# EAGLE design rocket-logger (EAGLE 6.2)
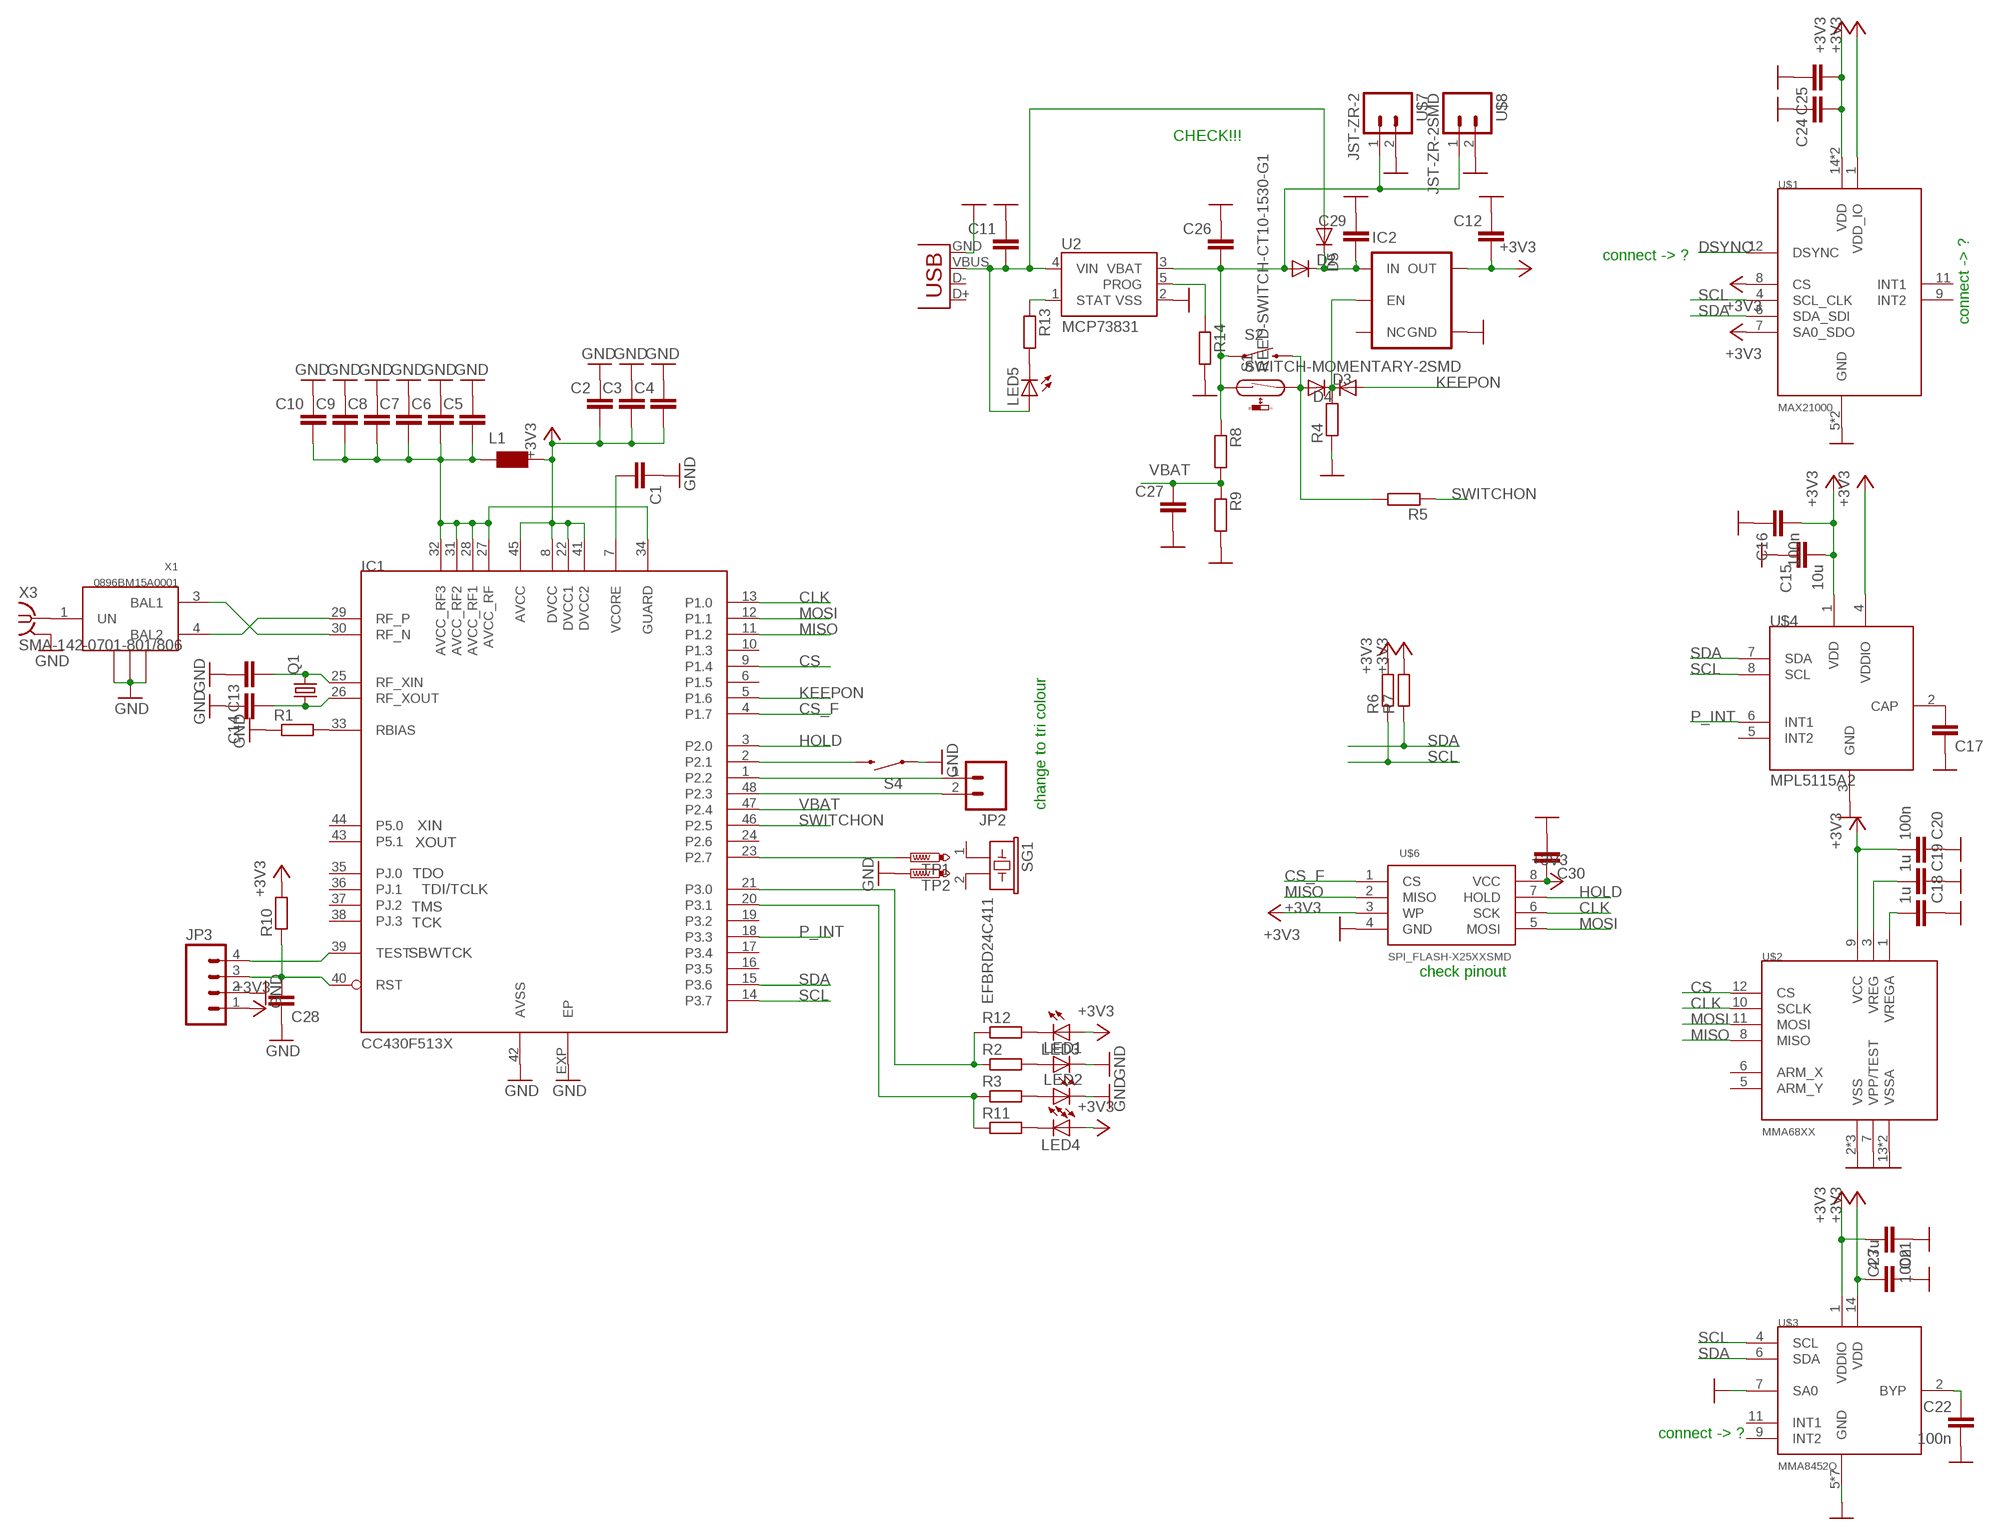
[diagram p0: schematic, sheet 1]

## Parts
C1  C-EUC0402  [C0402]
C2  C-EUC0402  [C0402]
C3  C-EUC0402  [C0402]
C4  C-EUC0402  [C0402]
C5  C-EUC0402  [C0402]
C6  C-EUC0402  [C0402]
C7  C-EUC0402  [C0402]
C8  C-EUC0402  [C0402]
C9  C-EUC0402  [C0402]
C10  C-EUC0402  [C0402]
C11  C-EUC0402  [C0402]
C12  C-EUC0402  [C0402]
C13  C-EUC0402  [C0402]
C14  C-EUC0402  [C0402]
C15  10u  C-EUC0402  [C0402]
C16  100n  C-EUC0402  [C0402]
C17  C-EUC0402  [C0402]
C18  1u  C-EUC0402  [C0402]
C19  1u  C-EUC0402  [C0402]
C20  100n  C-EUC0402  [C0402]
C21  4.7u  C-EUC0402  [C0402]
C22  100n  C-EUC0402  [C0402]
C23  100n  C-EUC0402  [C0402]
C24  C-EUC0402  [C0402]
C25  C-EUC0402  [C0402]
C26  C-EUC0402  [C0402]
C27  C-EUC0402  [C0402]
C28  C-EUC0402  [C0402]
C29  C-EUC0402  [C0402]
C30  C-EUC0402  [C0402]
D2  DIODE-SOD523  [SOD523]
D3  DIODE-SOD523  [SOD523]
D4  DIODE-SOD523  [SOD523]
D5  DIODE-SOD523  [SOD523]
IC1  CC430F513X  [QFN48]
IC2  V_REG_TPS76433SOT23-5  [SOT23-5]
JP2  M02PTH  [1X02]
JP3  M04PTH  [1X04]
L1  WE-MK_0603  [0603]
LED1  LED0603  [LED-0603]
LED2  LED0603  [LED-0603]
LED3  LED0603  [LED-0603]
LED4  LED0603  [LED-0603]
LED5  LED0603  [LED-0603]
Q1  CRYSTAL5X3  [CRYSTAL-SMD-5X3]
R1  R-EU_R0402  [R0402]
R2  R-EU_R0402  [R0402]
R3  R-EU_R0402  [R0402]
R4  R-EU_R0402  [R0402]
R5  R-EU_R0402  [R0402]
R6  R-EU_R0402  [R0402]
R7  R-EU_R0402  [R0402]
R8  R-EU_R0402  [R0402]
R9  R-EU_R0402  [R0402]
R10  R-EU_R0402  [R0402]
R11  R-EU_R0402  [R0402]
R12  R-EU_R0402  [R0402]
R13  R-EU_R0402  [R0402]
R14  R-EU_R0402  [R0402]
S1  REED-SWITCH-CT10-1530-G1  [CT10-G1]
S2  SWITCH-MOMENTARY-2SMD  [TACTILE_SWITCH_SMD]
S4  SWITCH-MOMENTARY-2SMD  [TACTILE_SWITCH_SMD]
SG1  EFBRD24C411  [EFBRD24C411]
TP1  PTR1B1,27  [B1,27]
TP2  PTR1B1,27  [B1,27]
U2  MCP73831  [SOT23-5]
U$1  MAX21000  [LGA16]
U$2  MMA68XX  [QFN16-6X6]
U$3  MMA8452Q  [QFN16-COL]
U$4  MPL5115A2  [LGA8]
U$6  SPI_FLASH-X25XXSMD  [SO08]
U$7  JST-ZR-2  [JST-ZR-2]
U$8  JST-ZR-2SMD  [JST-ZR-2-SMD]
X1  0896BM15A0001  [0896BM15A0001]
X2  USB-MICROB  [USB-MICROB]
X3  SMA-142-0701-801/806  [J502-ND-142-0701-801/806]

## Nets
+3V3: C2.2 C3.2 C4.2 C12.2 C15.2 C16.2 C20.2 C21.2 C23.1 C24.2 C25.2 C30.1 IC1.8(DVCC) IC1.22(DVCC1) IC1.41(DVCC2) IC1.45(AVCC) IC2.5(OUT) JP3.1 L1.2 LED3.A LED4.A R6.2 R7.2 R10.2 U$1.1(VDD_IO) U$1.7(SA0_SDO) U$1.8(CS) U$1.14(VDD) U$1.15(VDD) U$2.9(VCC) U$3.1(VDDIO) U$3.14(VDD) U$4.1(VDD) U$4.4(VDDIO) U$6.3(WP) U$6.8(VCC)
AVCC_RF2: C5.2 C6.2 C7.2 C8.2 C9.2 C10.2 IC1.27(AVCC_RF) IC1.28(AVCC_RF1) IC1.31(AVCC_RF2) IC1.32(AVCC_RF3) IC1.34(GUARD) L1.1
CLK: IC1.13(P1.0) U$2.10(SCLK) U$6.6(SCK)
CS: IC1.9(P1.4) U$2.12(CS)
CS_F: IC1.4(P1.7) U$6.1(CS)
DSYNC: U$1.12(DSYNC)
GND: C1.1 C2.1 C3.1 C4.1 C5.1 C6.1 C7.1 C8.1 C9.1 C10.1 C11.1 C12.1 C13.1 C14.1 C15.1 C16.1 C17.1 C18.1 C19.1 C20.1 C21.1 C22.2 C23.2 C24.1 C25.1 C26.1 C27.2 C28.1 C29.1 C30.2 IC1.42(AVSS) IC1.EXP(EP) IC2.2(GND) JP3.2 LED1.C LED2.C R1.1 R4.1 R9.2 R14.2 S4.1 TP2.TP U2.2(VSS) U$1.5(GND) U$1.10(GND) U$2.2(VSS) U$2.4(VSS) U$2.7(VPP/TEST) U$2.13(VSSA) U$2.16(VSSA) U$2.17(VSS) U$3.5(GND) U$3.7(SA0) U$3.8(GND) U$3.10(GND) U$3.12(GND) U$3.13(GND) U$3.15(GND) U$3.16(GND) U$4.3(GND) U$6.4(GND) U$7.2 U$8.2 X1.2(GND2) X1.5(GND) X1.6(GND1) X2.GND X3.G@1(GND)
HOLD: IC1.3(P2.0) U$6.7(HOLD)
KEEPON: D4.A IC1.5(P1.6)
MISO: IC1.11(P1.2) U$2.8(MISO) U$6.2(MISO)
MOSI: IC1.12(P1.1) U$2.11(MOSI) U$6.5(MOSI)
N$1: C11.2 D5.A LED5.A U2.4(VIN) X2.VBUS
N$2: C26.2 D2.A R8.1 S1.1 S2.1 U2.3(VBAT) U$7.1 U$8.1
N$3: IC1.30(RF_N) X1.3(BAL1)
N$4: IC1.29(RF_P) X1.4(BAL2)
N$5: IC1.33(RBIAS) R1.2
N$6: C13.2 IC1.25(RF_XIN) Q1.3
N$7: C14.2 IC1.26(RF_XOUT) Q1.1
N$8: X1.1(UN) X3.1
N$9: LED1.A R2.2
N$10: R13.1 U2.1(STAT)
N$11: IC1.1(P2.2) JP2.1
N$12: IC1.48(P2.3) JP2.2
N$13: C17.2 U$4.2(CAP)
N$14: C18.2 U$2.1(VREGA)
N$15: C19.2 U$2.3(VREG)
N$16: IC1.21(P3.0) R2.1 R12.1
N$17: IC1.20(P3.1) R3.1 R11.1
N$18: LED5.C R13.2
N$19: C22.1 U$3.2(BYP)
N$20: LED2.A R3.2
N$21: LED4.C R11.2
N$22: LED3.C R12.2
N$23: IC1.39(TEST) JP3.4
N$24: D3.A R5.2 S1.2 S2.3
N$25: D3.C D4.C IC2.3(EN) R4.2
N$26: C28.2 IC1.40(RST) JP3.3 R10.1
N$28: IC1.2(P2.1) S4.3
N$29: IC1.23(P2.7) TP1.TP
N$30: C29.2 D2.C D5.C IC2.1(IN)
N$33: R14.1 U2.5(PROG)
P_INT: IC1.18(P3.3) U$4.6(INT1)
SCL: IC1.14(P3.7) R6.1 U$1.4(SCL_CLK) U$3.4(SCL) U$4.8(SCL)
SDA: IC1.15(P3.6) R7.1 U$1.6(SDA_SDI) U$3.6(SDA) U$4.7(SDA)
SWITCHON: IC1.46(P2.5) R5.1
VBAT: C27.1 IC1.47(P2.4) R8.2 R9.1
VCORE: C1.2 IC1.7(VCORE)
Unconnected: IC1.6(P1.5) IC1.10(P1.3) IC1.16(P3.5) IC1.17(P3.4) IC1.19(P3.2) IC1.24(P2.6) IC1.35(PJ.0) IC1.36(PJ.1) IC1.37(PJ.2) IC1.38(PJ.3) IC1.43(P5.1) IC1.44(P5.0) IC2.4(NC) SG1.1 SG1.2 U$1.9(INT2) U$1.11(INT1) U$2.5(ARM_Y) U$2.6(ARM_X) U$3.9(INT2) U$3.11(INT1) U$4.5(INT2) X2.D+ X2.D-

## Notes on the sheet
- CHECK!!!
- connect -> ?
- connect -> ?
- change to tri colour
- check pinout
- connect -> ?

## Power pins joined to a net without a drawn wire
GND: X3.G@2(GND) X3.G@3(GND) X3.G@4(GND)

## Library data of the parts
C1-C30 = resistor:C-EU: CAPACITOR, European symbol
D2-D5 = diode:DIODE-: DIODE
IC1 = Mine:CC430F513X
IC2 = SparkFun:V_REG_TPS76433: Voltage Regulator Older TI part. LDO 150mA regulator. No output by-pass cap option. See V_REG_LDO for a better part.
JP2 = SparkFun:M02: Header 2 Standard 2-pin 0.1" header. Use with straight break away headers (SKU : PRT-00116), right angle break away headers (PRT-00553), swiss pins (PRT-00743), machine pins (PRT-00117), and female headers (PRT-00115). Molex polarized connector foot print use with SKU : PRT-08233 with associated crimp pins and housings.
JP3 = SparkFun:M04: Header 4 Standard 4-pin 0.1" header. Use with straight break away headers (SKU : PRT-00116), right angle break away headers (PRT-00553), swiss pins (PRT-00743), machine pins (PRT-00117), and female headers (PRT-00115). Molex polarized connector foot print use with SKU : PRT-08231 with associated crimp pins and housings.
L1 = wuerth-elektronik:WE-MK: SMD Multilayer Ceramic Inductors WE-MK - Windings printed on ceramic substrate - Extremely high SRF > 15 GHz - Inductance is stable over temperature -- High frequency circuits -- Bluetooth -- Wireless LAN -- Filter circuits
LED1-LED5 = SparkFun:LED: LEDs Standard schematic elements and footprints for 5mm, 3mm, 1206, and 0603 sized LEDs. 5mm - Spark Fun Electronics SKU : COM-00529 (and others)
Q1 = SparkFun:CRYSTAL: Crystals Various standard crystals. Proven footprints. Spark Fun Electronics SKU : COM-00534
R1-R14 = rcl:R-EU_: RESISTOR, European symbol
S1 = switch-reed:REED-SWITCH-: Reed Sensor; MF: COTO TECHNOLOGY; MPN: CT10-1530-G1; OC_FARNELL: 1081696
S2 S4 = SparkFun:SWITCH-MOMENTARY-2
SG1 = buzzer:EFB?: Piezoelectric Acoustic Transducer Source: Panbasonic .. 2SC1685.pdf; OC_FARNELL: unknown; OC_NEWARK: unknown
TP1 TP2 = testpad:PTR1: TEST PIN
U2 = SparkFun-PowerIC:MCP73831: Miniature single cell, fully integrated Li-Ion, Li-polymer charge management controller http://ww1.microchip.com/downloads/en/DeviceDoc/21984a.pdf IC-09995; PROD_ID: IC-09995
U$1 = Mine:MAX21000
U$2 = Mine:MMA68XX
U$3 = Mine:MMA8452Q
U$4 = Mine:MPL5115A2
U$6 = SparkFun:SPI_FLASH-X25XX: 8pin SPI Flash series x25xx. Works with devices like W25X32 and BR25L32
U$7 U$8 = Mine:JST-ZR-2
X1 = Mine:0896BM15A0001
X2 = SparkFun:USB: USB Connectors USB-B-PTH is fully proven SKU : PRT-00139 USB-miniB is fully proven SKU : PRT-00587 USB-A-PCB is untested. USB-A-H is throughly reviewed, but untested. Spark Fun Electronics SKU : PRT-00437 USB-B-SMT is throughly reviewed, but untested. Needs silkscreen touching up. USB-A-S has not been used/tested USB-MB-H has not been used/tested
X3 = con-coax:SMA-: SMA 50 Ohm End Launch Jack Receptacle - Round Contact Johnson Components Source: www.johnsoncomponents.com .. J502-ND.pdf; MF: JOHNSON COMPONENTS; MPN: 142-0701-801; OC_FARNELL: 1608592; OC_NEWARK: 90F2624

## Board
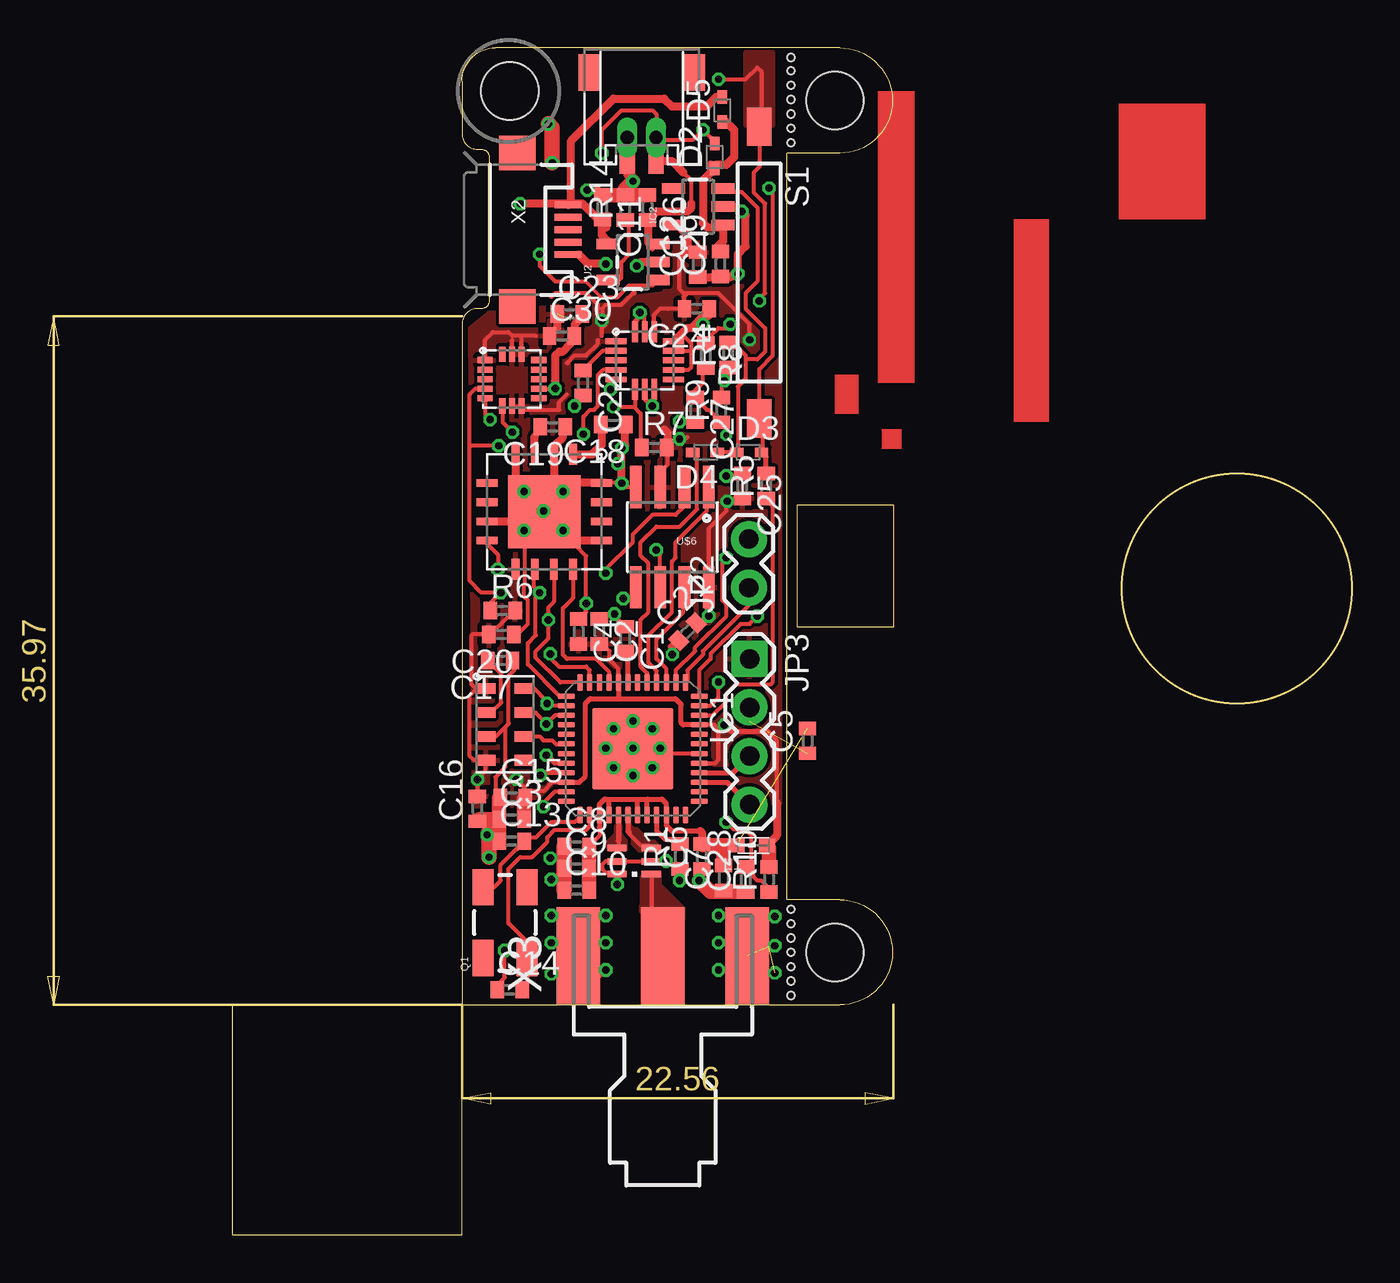
[diagram p1: board, top side]
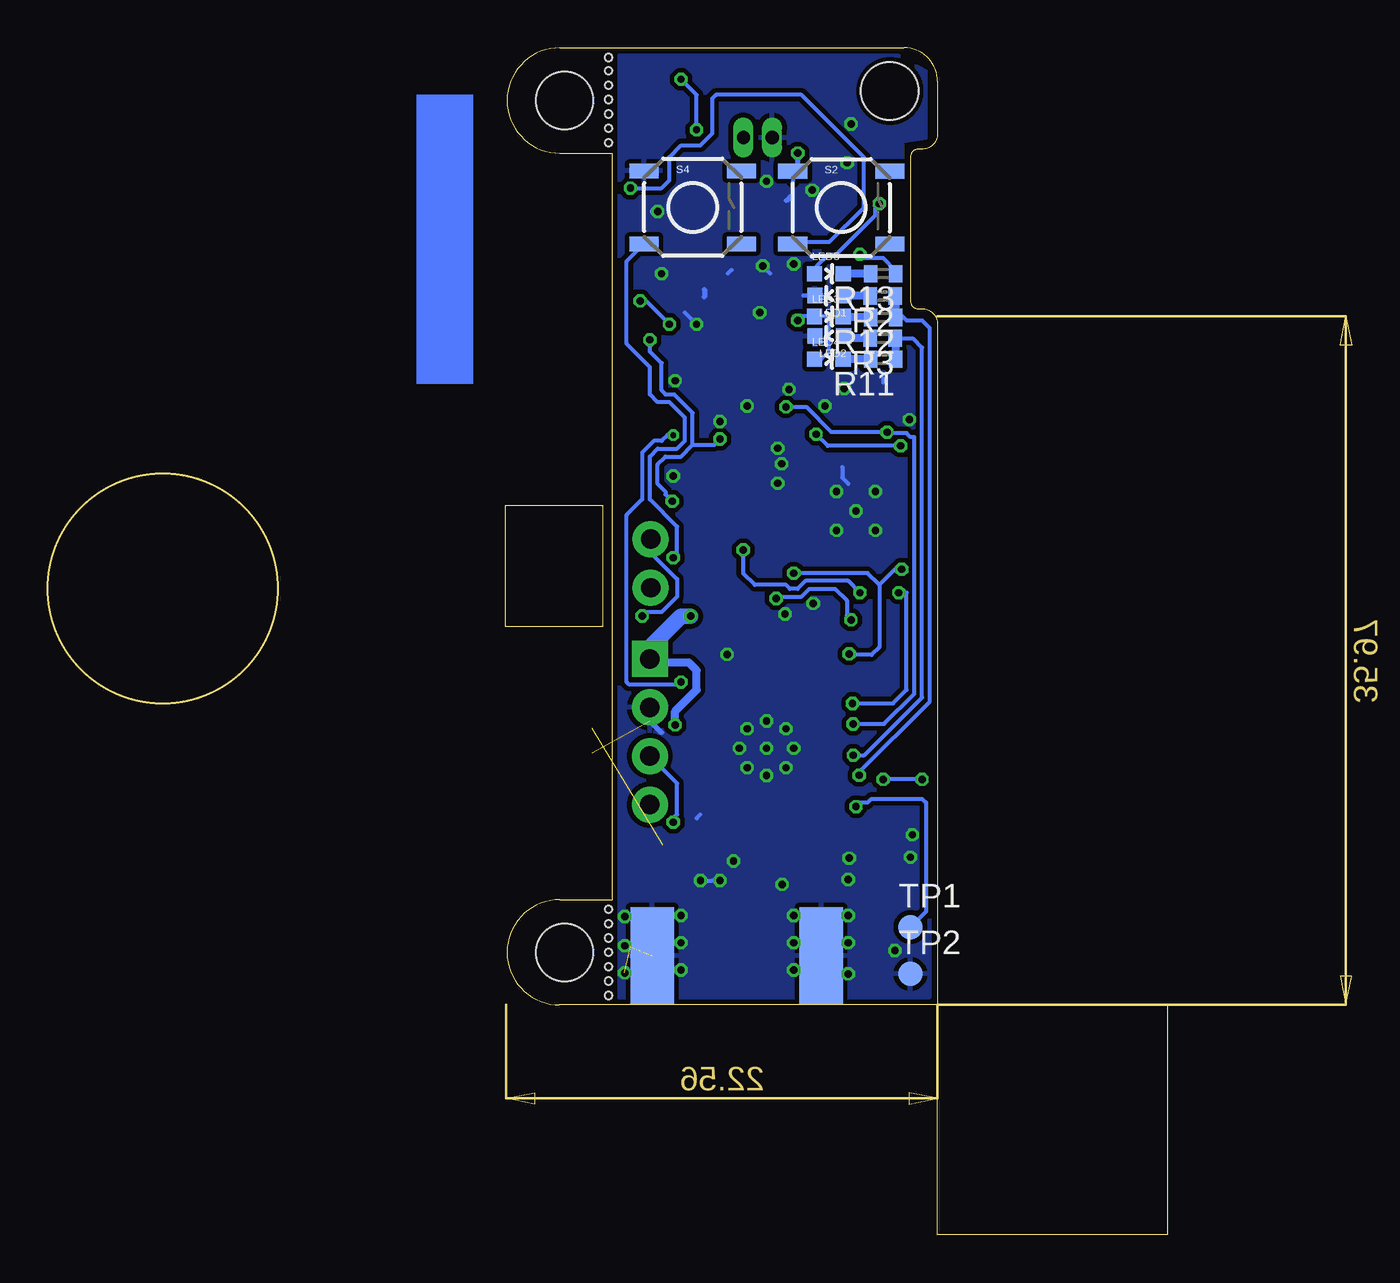
[diagram p2: board, bottom side, seen from below]

Size 58.5 x 62 mm. Coordinates in mm from the lower left corner, seen from the top.
Outline: 12,12 31.75,12 arc90 34.5,14.75 arc90 31.75,17.5 29,17.5 29,56.5 31.75,56.5 arc90 34.5,59.25 arc90 31.75,62 13.75,62 arc90 12,60.25 12,57.52 arc90 12.81,56.7 13.02,56.7 arc-90 13.42,56.3 13.42,48.78 arc-90 13.02,48.37 12.81,48.37 arc90 12,47.56 12,12
Outline: circle at 52.5,33.75 radius 6
Copper layers (1*16): Top 0.035mm / dielectric 0.2mm / Bottom 0.035mm
Design rules: minimum track width 6mil, minimum drill 12mil, track to track 7mil, track to pad 7mil, pad to pad 7mil, via to via 7mil, smd to smd 0mil, copper to edge 0mil, drill to drill 10mil, minimum pad ring 7mil, minimum via ring 6mil, stop-mask expansion 2mil, vias tented up to drill 25mil, thermal gap 10mil
Holes 3 mm at 14.5,59.75 31.5,14.75 31.5,59.25
Holes 0.38 mm at 29.2,57.05 29.2,57.8 29.2,58.55 29.2,59.3 29.2,60.05 29.2,60.8 29.2,61.5 29.2,17 29.2,16.25 29.2,15.5 29.2,14.75 29.2,14 29.2,13.25 29.2,12.5

### Footprints (pad centres in the part's own frame; a part is rotated, then mirrored left to right if it is on the bottom)
C0402 = smd 0.7 x 0.9: 1 -0.65,0; 2 0.65,0
SOD523 = smd 0.7 x 0.5: A 0.7,0; C -0.6,0
QFN48 = smd 0.9 x 0.3: 1 -3.462,2.75; 2 -3.462,2.25; 3 -3.462,1.75; 4 -3.462,1.25; 5 -3.462,0.75; 6 -3.462,0.25; 7 -3.462,-0.25; 8 -3.462,-0.75; 9 -3.462,-1.25; 10 -3.462,-1.75; 11 -3.462,-2.25; 12 -3.462,-2.75; 25 3.462,-2.75; 26 3.462,-2.25; 27 3.462,-1.75; 28 3.462,-1.25; 29 3.462,-0.75; 30 3.462,-0.25; 31 3.462,0.25; 32 3.462,0.75; 33 3.462,1.25; 34 3.462,1.75; 35 3.462,2.25; 36 3.462,2.75 | smd 0.3 x 0.9: 13 -2.75,-3.462; 14 -2.25,-3.462; 15 -1.75,-3.462; 16 -1.25,-3.462; 17 -0.75,-3.462; 18 -0.25,-3.462; 19 0.25,-3.462; 20 0.75,-3.462; 21 1.25,-3.462; 22 1.75,-3.462; 23 2.25,-3.462; 24 2.75,-3.462; 37 2.75,3.462; 38 2.25,3.462; 39 1.75,3.462; 40 1.25,3.462; 41 0.75,3.462; 42 0.25,3.462; 43 -0.25,3.462; 44 -0.75,3.462; 45 -1.25,3.462; 46 -1.75,3.462; 47 -2.25,3.462; 48 -2.75,3.462 | smd 4.25 x 4.25: EXP 0,0
SOT23-5 = smd 0.55 x 1.2: 1 -0.95,-1.3; 2 0,-1.3; 3 0.95,-1.3; 4 0.95,1.3; 5 -0.95,1.3
1X02 = drill 1.016 pad 1.88: 1 0,0; 2 2.54,0
1X04 = drill 1.016 pad 1.88 square: 1 0,0 | drill 1.016 pad 1.88: 2 2.54,0; 3 5.08,0; 4 7.62,0
0603 = smd 0.85 x 0.7: 1 -0.9,0; 2 0.7,0
LED-0603 = smd 0.8 x 0.8: A 0,-0.75; C 0,0.75
CRYSTAL-SMD-5X3 = smd 1.9 x 1.1: 1 -1.85,-1.15; 2 1.85,-1.15; 3 1.85,1.15; 4 -1.85,1.15
R0402 = smd 0.7 x 0.9: 1 -0.65,0; 2 0.65,0
CT10-G1 = smd 2 x 1.3: 1 -7.62,0; 2 7.62,0
TACTILE_SWITCH_SMD = smd 1.524 x 0.762: 1 -2.54,1.905; 2 2.54,1.905; 3 -2.54,-1.905; 4 2.54,-1.905
EFBRD24C411 = drill 1.1 pad 1.676: 1 -5,0; 2 5,0
B1,27 = smd 1.27 x 1.27: TP 0,0
LGA16 = smd 0.8 x 0.323: 1 -1.4,1; 2 -1.4,0.5; 3 -1.4,0; 4 -1.4,-0.5; 5 -1.4,-1; 9 1.4,-1; 10 1.4,-0.5; 11 1.4,0; 12 1.4,0.5; 13 1.4,1 | smd 0.323 x 0.8: 6 -0.5,-1.4; 7 0,-1.4; 8 0.5,-1.4; 14 0.5,1.3; 15 0,1.3; 16 -0.5,1.3
QFN16-6X6 = smd 1.1 x 0.4: 1 -3,1.5; 2 -3,0.5; 3 -3,-0.5; 4 -3,-1.5; 9 3,-1.5; 10 3,-0.5; 11 3,0.5; 12 3,1.5 | smd 0.4 x 1.1: 5 -1.5,-3; 6 -0.5,-3; 7 0.5,-3; 8 1.5,-3; 13 1.5,3; 14 0.5,3; 15 -0.5,3; 16 -1.5,3 | smd 3.8 x 3.8: 17 0,0
QFN16-COL = smd 1.1 x 0.3: 1 -1.5,1; 2 -1.5,0.5; 3 -1.5,0; 4 -1.5,-0.5; 5 -1.5,-1; 9 1.5,-1; 10 1.5,-0.5; 11 1.5,0; 12 1.5,0.5; 13 1.5,1 | smd 0.3 x 1.1: 6 -0.5,-1.5; 7 0,-1.5; 8 0.5,-1.5; 14 0.5,1.5; 15 0,1.5; 16 -0.5,1.5
LGA8 = smd 1 x 0.55: 1 -1,1.875; 2 -1,0.625; 3 -1,-0.625; 4 -1,-1.875; 5 1,-1.875; 6 1,-0.625; 7 1,0.625; 8 1,1.875
SO08 = smd 0.61 x 2.21: 1 -1.905,-2.616; 2 -0.635,-2.616; 3 0.635,-2.616; 4 1.905,-2.616; 5 1.905,2.616; 6 0.635,2.616; 7 -0.635,2.616; 8 -1.905,2.616
JST-ZR-2 = drill 0.7 pad 1.016 long: 1 0.75,0; 2 -0.75,0
JST-ZR-2-SMD = smd 0.8 x 2.2: 1 0.6,-1.1; 2 -0.9,-1.1 | smd 1.1 x 1.9: TB1 -2.9,3.1; TB2 2.6,3.1
0896BM15A0001 = smd 0.35 x 1: 1 0.65,0.9; 2 0,0.9; 3 -0.7,0.9; 4 -0.7,-0.9; 5 0,-0.9; 6 0.65,-0.9
USB-MICROB = smd 0.35 x 1.4: D+ 0,2.65; D- -0.65,2.65; GND 1.3,2.65; ID 0.65,2.65; VBUS -1.3,2.65 | smd 1.8 x 1.9: MT1 -4,0; MT2 4,0
J502-ND-142-0701-801/806 = smd 5.08 x 2.286: 1 2.565,0; G@1 2.565,4.42; G@2 2.565,-4.42 | smd 5.08 x 2.286 bottom: G@3 2.565,4.42; G@4 2.565,-4.42

### Placement (x,y rotation side)
C1  20.54,31.11 270 top
C2  19.19,31.52 270 top
C3  14.61,21.7 0 top
C4  18.1,31.51 270 top
C5  30.06,25.8 90 top
C6  24.55,19.75 90 top
C7  25.68,18.64 90 top
C8  18,20.3 0 top
C9  18,19.15 0 top
C10  18,18 0 top
C11  19.35,53.68 270 top
C12  24.33,50.67 90 top
C13  14.61,20.56 0 top
C14  14.5,12.8 0 top
C15  14.66,22.85 0 top
C16  12.81,22.25 90 top
C17  14,30 180 top
C18  19.92,42.33 180 top
C19  16.75,42.2 180 top
C20  14.06,31.36 180 top
C21  23.8,31.5 45 top
C22  18.33,44.5 270 top
C23  17.64,48.1 0 top
C24  24.28,48.37 180 top
C25  26.66,39.12 270 top
C26  21.7,53.66 270 top
C27  24.19,43.09 270 top
C28  26.83,18.55 90 top
C29  25.51,50.71 90 top
C30  17.23,46.95 0 top
D2  25.21,56.3 90 top
D3  26.96,40.87 0 top
D4  24.76,40.87 180 top
D5  25.61,58.74 90 top
IC1  20.93,25.38 270 top
IC2  24.35,53.71 90 top
JP2  27,33.8 90 top
JP3  27.04,30.08 270 top
L1  27.24,20.33 0 top
LED1  17.66,49.06 90 bottom
LED2  17.66,46.95 90 bottom
LED3  17.69,47.97 270 bottom
LED4  17.69,45.73 270 bottom
LED5  17.69,50.2 270 bottom
Q1  14.25,16.3 90 top
R1  23.4,19.75 90 top
R2  14.88,49.03 180 bottom
R3  14.88,46.83 180 bottom
R4  25.92,45.95 90 top
R5  27.9,39.12 90 top
R6  14.13,32.6 0 top
R7  22.06,41.12 0 top
R8  24.75,45.93 270 top
R9  25.56,43.09 90 top
R10  28.05,18.55 90 top
R11  14.84,45.73 180 bottom
R12  14.84,47.92 180 bottom
R13  14.84,50.2 180 bottom
R14  20.53,53.66 90 top
S1  27.54,50.26 270 top
S2  17.03,53.65 0 bottom
S4  24.8,53.67 0 bottom
SG1  12.25,-39 0 top  (outside the outline)
TP1  13.42,16.06 0 bottom
TP2  13.42,13.63 0 bottom
U2  20.94,50.81 90 top
U$1  14.62,44.69 0 top
U$2  16.31,37.76 270 top
U$3  21.55,45.68 0 top
U$4  14.26,26.66 0 top
U$6  23,36.44 180 top
U$7  21.4,57.31 0 top
U$8  21.55,57.62 0 top
X1  21,19.5 270 top
X2  14.91,52.5 270 top
X3  22.5,12 90 top

### Tracks (layer width: path | path; a pad name or v marks a point on that pad's centre or on a via)
+3V3  (via drill 0.38)  (1 unrouted)
  Top 0.203: IC1.22 16.73,23.63 16.27,23.18 15.25,23.18 | 14.78,32.87 R6.2 14.72,32.61 13.83,31.71 13.77,31.71 C20.2 12.55,31.36 12.5,31.3 12.5,28.75 12.71,28.54 U$4.1 12.79,28.54 12.4,28.15 12.41,28.14 12.41,25.01 12.63,24.79 U$4.4 13.22,24.75 13.22,24.2 v12.81,23.79 C16.2 | 14.85,34.73 U$2.9 | 24.8,32.12 24.8,32.32 | 24.8,32.32 24.8,32.93 | 24.8,32.93 24.8,33.74 | 24.8,33.74 24.8,33.79 | IC1.8 20.18,29.57 19.72,30.03 19.72,30.49 19.35,30.87 | v19.32,47.76 19.52,47.56 19.32,47.36 | 25.01,32.73 24.8,32.93 | 28,26.27 28.46,25.82 28.46,22.57 | 24.63,24.63 25.24,24.63 25.41,24.8 25.41,26.43 25.21,26.63 IC1.45 | 19.52,47.97 v19.32,47.76 | 16.67,48.98 16.88,49.19 18.5,49.19 19.11,48.58 19.11,47.97 v19.32,47.76 | v19.32,47.76 19.32,48.37 19.52,48.58 20.33,48.58 20.94,49.19 21.04,49.19 | 19.45,47.63 v19.32,47.76 | 23.79,49.19 25.41,49.19 27.04,47.56 v27.04,46.75 | 23.79,49.19 23.58,48.98 23.58,48.42 C24.2 22.77,48.37 22.36,48.37 22.05,48.06 U$3.14 | C21.2 24.55,31.96 v24.9,32.32 24.8,32.32 | 24.8,33.74 24.88,33.82 U$6.8 24.91,36.89 25.82,37.81 25.82,38.26 v25.87,38.31 25.9,38.28 26.48,38.28 C25.2 | 15.25,23.18 15.25,23.38 v14.85,23.79 | 15.25,23.18 15.31,23.12 C15.2 15.26,22.8 | U$1.14 15.12,46.88 15.05,46.95 | 15.05,46.95 14.64,46.95 14.44,47.15 13.63,47.15 13.22,46.74 U$1.1 | 15.86,46.95 15.05,46.95 | 23.69,51.32 23.76,51.39 23.79,51.39 | 23.79,49.19 23.58,49.19 23.38,49.39 23.38,51.01 23.58,51.22 24.02,51.22 | 23.79,41.67 23.58,41.46 23.25,41.46 | C12.2 24.3,51.32 24.19,51.22 | IC2.5 23.26,52.76 23.46,52.55 | U$1.7 U$1.8 15.32,43.09 17.08,43.09 17.08,43.5 17.49,43.9 | 19.11,46.75 19.11,46.54 18.5,45.93 17.89,45.93 17.54,45.58 17.54,45.53 17.49,45.53
  Top 0.203: 19.32,46.95 v19.32,47.76 | U$1.15 14.62,46.72 14.64,46.75 | U$6.3 22.37,39.84 22.77,40.25 22.77,41.06 R7.2
  Top 0.254: IC1.22 18.13,23.63 18.45,23.95 18.45,27.75 18.7,28 20.13,28 | IC1.45 23.57,26.63 23.45,26.75 23.45,27.7 23.16,28 20.13,28 | IC1.41 24.63,24.63 | JP3.1 27.04,29.68 | 28,26.27 26.07,26.27 v25.72,26.63 25.51,26.43 25.41,26.43 | IC1.8 20.18,28.05 20.13,28
  Top 0.406: 23.46,52.55 23.79,52.23 23.79,51.39 | C12.2 23.69,51.32 | 22.77,41.27 22.77,41.87 22.57,42.07 | C23.1 16.99,47.35 C30.1 | 28.46,22.57 28.46,20.85 L1.2
  Top 0.762: 15.26,22.8 C3.2 | R10.2 28.05,20.22 L1.2
  Bottom 0.203: v12.81,23.79 v14.85,23.79 | v19.32,47.76 19.52,47.97 LED3.A 17.89,47.97 17.69,47.76 17.69,46.14 18.1,45.73 LED4.A | v27.04,46.75 27.04,46.14 26.43,45.53 26.43,44.11 26.22,43.9 25.77,43.9 24.8,42.94 24.8,41.26 | v25.87,38.31 26.22,38.67 26.22,38.82 26.63,39.23 26.63,40.25 26.22,40.65 25.41,40.65 24.8,41.26 | 24.8,41.26 23.68,41.26 v23.38,41.57
  Bottom 0.254: 26.63,29.68 JP3.1
  Bottom 0.406: v25.72,26.63 25.72,27.34 24.6,28.46 24.6,29.48 25.01,29.88 26.83,29.88 JP3.1
  Bottom 0.813: JP3.1 27.04,30.69 25.41,32.32 v24.9,32.32
  pour Top: 28.46,51.83 22.77,51.83 22.57,49.19 13.83,48.17 13.42,48.17 12.41,47.36 12.61,22.36 28.66,22.57 28.66,51.42
AVCC_RF2  (1 unrouted)
  Top 0.203: 19.5,22.75 19.66,22.75 19.68,22.73 | 19.45,22.75 19.5,22.75 19.52,22.77 21.14,22.77 21.18,22.73 | 19.18,21.28 19.18,20.83 C8.2
  Top 0.254: 19.18,21.28 IC1.27 19.18,22.48 19.45,22.75 19.5,22.75 21.7,22.75 | 21.7,22.75 22.45,22.75 22.68,22.52 IC1.34 22.68,21.36 22.95,21.1 24.46,21.1 | IC1.31 21.18,22.73 | IC1.32 21.68,22.73 21.7,22.75 | IC1.28 19.68,22.73
  Top 0.406: 24.46,21.1 24.55,21.01 C6.2 24.62,20.33
  Top 0.762: C10.2 C9.2 C8.2 | 24.62,20.33 25.61,20.33 | 25.61,20.33 L1.1 | C7.2 25.68,20.27 25.61,20.33
CLK  (via drill 0.38)
  Top 0.203: IC1.13 17.12,28.14 15.45,29.8 15.45,30.9 15.86,31.3 15.86,33.34 v16.06,33.54 15.75,33.85 15.75,34.7 U$2.10 | U$6.6 22.37,35.57 v22.16,35.77
  Bottom 0.203: v22.16,35.77 22.16,34.55 21.55,33.95 19.93,33.95 19.72,33.74 19.32,33.74 18.91,34.15 16.67,34.15 v16.06,33.54
CS
  Top 0.203: 17.69,34.64 U$2.12 17.81,33.25 17.28,32.73 17.28,30.29 17.49,30.09 19.01,30.09 19.68,29.41 IC1.9
CS_F
  Top 0.203: U$6.1 24.8,38.95 24.8,37.81 23.18,36.18 23.18,35.37 22.97,35.16 22.97,32.52 21.75,31.3 21.75,29.88 22.18,29.45 IC1.4
GND  (via drill 0.38)  (3 unrouted)
  Top 0.203: 12.96,26.04 U$4.3 13.79,26.04 14.25,26.5 | 14.25,26.5 14.25,24.41 13.75,23.91 13.75,22.9 13.8,22.85 C15.1 13.96,22.8 | 14.25,26.5 14.45,26.7 14.45,29.2 14.75,29.5 14.75,29.9 C17.1 14.71,30.06 | 20.99,39.01 20.99,39.1 | 15.81,37.26 15.9,37.36 | 15.9,37.36 U$2.17 | 18.5,32.52 v18.5,32.98 | v18.5,32.98 18.5,35.45 17.89,36.06 17.89,36.38 18.02,36.26 | C14.1 13.85,13.04 14.23,13.42 v14.23,14.85 14.23,15.05 | C9.1 17.35,19.45 | C10.1 17.35,18.03 | 23.18,19.32 22.97,19.32 22.79,19.5 X1.2 X1.5 19.5,19.5 19.32,19.32 19.32,19.11 19.52,18.91 20.13,18.91 20.13,18.88 X1.6 20.1,18.33 v20.13,18.3 | 23.18,19.32 23.29,19.32 | v25.82,39.64 26.53,39.64 C25.1 | IC1.42 23.05,25.13 22.8,25.38 IC1.EXP 20.94,25.39 v20.94,25.41 | 25.74,18.06 C7.1 25.76,17.9 | U$1.5 13.22,42.84 v13.47,42.58 | 12.92,21.7 C16.1 | 16.76,44.6 16.88,44.72 v16.88,44.21 16.86,44.19 U$1.10 | C27.2 23.42,42.44 v23.38,42.48 | R4.1 25.92,44.82 v25.72,44.61 25.56,44.46 R9.2 | X2.GND 17.3,51.2 17.28,51.22 | 18.1,14.64 18.1,14.85 19.11,13.83 v19.52,13.83 19.11,13.42 | U$7.2 U$8.2 | 16.81,38.26 U$2.17 | 14.81,39.26 U$2.17 | 17.83,39.28 17.73,39.18 | 17.73,39.18 U$2.17 | U$2.16 19.5,39.26 19.52,39.28 20.33,39.28 v20.36,39.25 20.56,39.05 U$6.4 21.05,39.05 21,39 | 17.22,41.82 17.43,41.82 | 16.88,40.83 U$2.2 | C2.1 19.44,32.42 v19.98,32.42 19.98,32.32 C1.1 | R1.1 23.18,19.32 | 16.25,37.01 | 16.25,37.01 15.9,37.36 | 17.28,19.72 16.67,19.72 v16.62,19.67 | C4.1 18.5,32.56 v18.5,32.98 | 24.6,48.03 C24.1 24.93,48.04 25.01,47.97 v24.6,47.56 | 17.22,41.82 17.22,42.18 17.24,42.2 C19.1 | 17.76,39.01 17.76,39.16 17.73,39.18 | C20.1 14.9,31.36 15.45,31.91 15.45,33.13 15.25,33.34 15.25,33.89 15.3,33.95 15.3,35.96 15.25,36.01 16.25,37.01
  Top 0.203: U$3.15 21.55,48.12 | U$3.16 21.05,47.72 | 17.22,41.82 17.28,41.88 | U$3.7 21.55,43.9 | U$3.8 22.05,43.59 | 23.38,46.95 23.12,46.95 23.12,46.75 U$3.13 | v17.89,43.29 17.89,43.41 C22.2 | v19.77,44.16 19.77,44.39 U$3.5 | U$3.10 23.84,45.18 23.99,45.33 23.99,46.14 | 23.99,46.14 23.99,46.54 23.48,47.05 | U$3.12 23.95,46.18 23.99,46.14 | v28.36,16.62 28.2,16.62 26.43,14.85 | v28.36,15.1 28.1,15.1 28.05,15.05 | 20.53,42.14 20.53,42.29 C18.1
  Top 0.254: 16.56,37.01 16.25,37.01 16.5,36.76 16.5,36.5 | 15.56,39.01 16.66,37.91 17.76,39.01 | 20.99,39.01 21,39 | X2.GND 18.11,51.2 | 21.55,43.9 21.55,43.7 v21.96,43.29 22.05,43.39 22.05,43.59 | 21.05,47.72 21.3,47.97 v21.3,48.17 21.5,48.17 21.55,48.12 | v16.67,18.55 16.75,18.55 C9.1
  Top 0.406: X3.G@4 26.71,14.56 26.43,14.85 26.02,15.25 v25.41,15.25 | X3.G@1 18.22,14.56 18.91,15.25 v19.52,15.25 | 26.58,53.5 v26.63,53.45 | v26.63,53.45 26.83,53.25 26.83,51.62 26.43,51.22 26.43,50.41 26.05,50.02 25.21,50.02 | 25.07,50.02 C12.1 25.21,50.02 | C6.1 24.39,18.95 v24.39,18.5 | 25.61,17.9 25.68,17.96 C7.1 25.59,17.9 24.99,17.9 | v18.55,54.57 19.1,54.57 C11.1 19.37,54.31 | 21.66,54.27 C26.1 | U$7.2 20.65,55.37 20.94,55.08 | v19.52,50.71 18.6,50.71 18.11,51.2 | U2.2 21.35,50.81 v21.14,50.61 | C29.1 25.24,50.06 25.21,50.02 | IC2.2 26.38,53.71 v26.63,53.45 | 16.88,40.83 16.88,41.26 17.28,41.67 17.28,41.88 | 20.53,42.14 20.53,41.26 20.33,41.06 20.33,39.28 | 24.6,48.03 24.6,47.97 23.99,47.36 23.79,47.36 23.48,47.05 23.38,46.95 | v16.88,44.21 16.88,45.93 17.08,46.14 17.28,46.14 17.69,46.54 17.69,46.76 C30.2 17.89,46.96 17.89,47.56 18.29,47.95 C23.2 | 19.52,39.28 17.83,39.28 | U$2.13 18.02,36.26 | U$2.2 16.81,39.5 16.88,39.43 16.88,38.42 v16.27,37.81 | U$2.4 14.81,39.26 | U$2.7 14.78,37.26 v15.25,36.79 | 13.42,21.04 13.42,21.7 | v23,30.31 23,30.67 22.97,30.69 22.99,30.69 C21.1
  Top 0.762: 13.96,22.8 C3.1 | 12.92,21.7 13.42,21.7 C3.1 | C13.1 C3.1 | C28.1 24.99,17.9 v24.39,18.5 | 19.37,54.31 R14.2 | R14.2 C26.1 | R14.2 20.53,54.62 v20.94,55.03
  Top 0.813: C10.1 C9.1 C8.1 | v16.72,55.99 16.72,57.82 v16.52,58.02 | v13.42,19.72 13.42,21.04
  Bottom 0.203: 14.85,44.51 14.85,44.72 | 16.99,40.11 16.99,39.54 16.67,39.23 | LED1.C 19.04,49.06 | v24.39,18.5 23.79,18.5 | v20.13,18.3 19.93,18.3 | 24.6,21.75 24.39,21.96 | v21.96,43.29 22.16,43.29 | v23.38,42.48 23.38,42.68 | v24.6,47.56 25.21,48.17 | 22.77,50.41 22.97,50.2 | v21.14,50.61 20.74,50.2
  Bottom 0.254: 24.19,49.39 24.19,48.98 | 27.04,27.44 27.04,26.83 26.43,26.22 | 19.66,54.27 19.9,54.02
  Bottom 0.406: v26.63,53.45 26.83,53.45
  other vias: 16.67,13.63 16.67,15.25 16.67,16.67 19.52,16.67 25.41,13.83 25.41,16.67 20.36,41.08 22.67,19.52 23.38,18.5 26.43,50.2 20.94,26.83 19.52,25.41 20.94,23.99 22.36,25.41 21.96,26.43 19.92,26.43 19.92,24.4 21.96,24.4 15.25,38.82 17.28,38.82 17.28,36.79 28.36,13.68 13.32,20.89 20.16,40.27
  pour Bottom (isolate 0.254): 14.03,61.58 28.66,61.58 28.66,12.41 12.41,12.41 12.41,47.56 13.83,48.37 13.83,57.11 12.61,57.31 12.61,60.77
HOLD
  Top 0.203: 23.58,34.76 23.58,33.95 23.63,33.9 U$6.7 23.58,33.77 23.58,32.52 22.16,31.1 22.16,30.09 22.68,29.56 IC1.3
KEEPON
  Top 0.203: 24.06,40.92 D4.A 24.09,40.84 24.29,40.84 24.29,37.91 23.38,36.99 22.16,36.99 21.35,36.18 21.35,35.47 21.75,35.06 21.75,32.52 21.35,32.12 21.35,29.68 21.68,29.34 IC1.5
MISO  (via drill 0.38)
  Top 0.203: U$2.8 13.31,36.09 13.88,35.52 v13.88,34.76 | v19.52,34.55 19.52,34.76 20.94,36.18 20.94,36.59 21.96,37.6 23.18,37.6 23.63,38.06 U$6.2 | IC1.11 18.68,29.5 18.5,29.68 17.08,29.68 16.67,30.09 16.67,30.29 v16.62,30.34
  Bottom 0.203: v13.88,34.76 14.23,34.76 15.05,33.95 | 15.05,33.95 15.05,30.69 15.45,30.29 16.57,30.29 v16.62,30.34 | 15.05,33.95 15.66,34.55 v19.52,34.55
MOSI  (via drill 0.38)
  Top 0.203: 16.75,34.7 U$2.11 16.81,33.07 16.52,32.78 v16.52,32.12 16.52,31.15 15.86,30.49 15.86,30.14 17.15,28.85 IC1.12 | 21.09,33.16 21.09,33.08 20.94,33.23 v20.43,33.23
  Top 0.305: U$6.5 21.09,33.16
  Bottom 0.203: v20.43,33.23 20.33,33.34 19.11,33.34 18.71,33.74 17.36,33.74 16.75,33.13 16.75,32.35 v16.52,32.12
N$1  (via drill 0.38)
  Top 0.203: 17.5,53.86 X2.VBUS
  Top 0.406: D5.A 25.3,59.44 24.8,58.94 22.97,58.94 22.57,59.35 19.93,59.35 17.69,57.11 17.69,53.93 X2.VBUS 17.62,53.86 18.3,53.86 19.21,52.95 | 19.54,52.62 19.21,52.95 | C11.2 19.3,53.03 19.21,52.95 | 19.44,52.93 C11.2 | U2.4 19.64,51.91 19.32,52.23 19.32,53 C11.2 | 17.5,53.86 v15.05,53.86
  Bottom 0.203: 18.64,50.41 LED5.A 18.3,50.34 18.3,50.61 17.69,51.22 17.28,51.22 15.25,53.25 15.25,53.66 v15.05,53.86
N$2  (via drill 0.38)
  Top 0.203: 23.58,55.48 23.99,55.08 23.99,53.86 | 22.36,56.09 22.36,56.31 U$8.1 | 25.82,47.56 v26.02,47.56 25.82,47.36 25.41,47.36 25.01,46.95 25.01,46.54 25.05,46.58 R8.1 | U$8.1 22.26,56.63 22.26,57.2 24.08,57.2 v24.6,57.72 25.21,57.11 D2.A | U$8.1 | v27.55,48.78 27.65,48.88 27.65,48.98 27.85,49.19 27.85,53.86 27.24,54.47 27.24,55.48 27.54,55.79 S1.1 27.65,57.99 27.65,60.77 27.44,60.97 26.83,60.36 v25.41,60.36 | 21.59,52.89 C26.2 | 22.02,51.56 21.96,51.62 | v19.32,56.5 19.32,57.72 20.33,58.74 21.96,58.74 22.16,58.53 22.16,57.33 U$7.1 | U2.3 22.02,51.76 21.75,52.03
  Top 0.254: 21.96,51.62 21.96,51.5 | 21.96,56.33 U$8.1 | 22.26,57.2 U$7.1
  Top 0.406: 21.96,51.62 21.75,51.83 21.75,52.03 21.75,52.95 C26.2 21.71,53.01 22.16,53.45 23.79,53.45 23.99,53.66 23.99,53.86 | 22.36,56.09 22.97,56.09 23.58,55.48
  Bottom 0.203: v27.55,48.78 27.24,48.78 v26.02,47.56 | S2.1 19.57,55.02 | v24.6,57.72 24.6,59.55 v25.41,60.36
  Bottom 0.254: v19.32,56.5 19.32,55.81 S2.1
  pour Top (no thermals): 26.83,61.78 28.26,61.78 28.26,57.92 26.83,57.92
N$3
  Top 0.203: 20.75,21 20.75,20.93 21.35,20.33 21.77,20.33 X1.3
  Top 0.254: IC1.30 20.68,21.07 20.75,21
  pour Top (rank 2, no thermals): 20.84,22.36 20.48,22.36 20.43,21.91 20.43,20.89 21.25,20.08 22.21,20.08 22.21,20.38 22.06,20.53 21.8,20.53 20.94,21.4 20.94,21.86
N$4
  Top 0.203: 20.18,20.57 20.18,20.28 X1.4
  Top 0.254: IC1.29 20.18,20.57
  pour Top (no thermals): 20.33,21.96 20.33,20.94 20.59,20.69 20.59,20.13 20.53,20.08 19.77,20.08 19.62,20.23 19.62,20.53 20.03,20.94 20.03,21.86 20.08,21.91
N$5
  Top 0.203: 23.25,20.65 23.4,20.5 R1.2
  Top 0.254: IC1.33 22.18,21.11 22.65,20.65 23.25,20.65
N$6
  Top 0.203: 15.45,20.53 15.25,20.53 15.27,20.56 C13.2 14.88,20.18 14.88,20.13 14.85,20.13 14.03,19.32 14.03,18.5 13.68,18.15 Q1.3 | IC1.25 18.18,21.84 17.89,21.55 16.67,21.55 15.86,20.74 15.49,20.74
  Top 0.254: 15.08,20.33 15.49,20.74 15.44,20.74 C13.2
N$7
  Top 0.203: IC1.26 18.71,21.9 18.71,21.35 18.51,21.15 16.85,21.15 16.47,20.77 16.47,20.53 15.66,19.72 15.05,19.72 14.44,19.11 14.44,16.27 15.45,15.25 15.45,14.5 Q1.1 15.4,13.05 C14.2
N$8
  Top 0.203: X1.1 21.9,16.93 22.57,16.27 22.57,14.63 X3.1
  pour Top (no thermals): 22.36,18.91 22.36,18.3 23.58,17.08 23.58,16.47 21.75,16.47 21.35,16.88 21.35,17.18 21.4,17.23 21.4,18.71 21.55,18.86
N$9
  Bottom 0.203: 15.55,49.06 R2.2
  Bottom 0.406: 15.55,49.06 LED1.A
N$10  (via drill 0.38)
  Top 0.178: 18.45,49.8 19.26,48.98
  Top 0.203: 19.26,48.98 20.13,48.98 20.74,49.59 21.97,49.59 U2.1 | v16.06,51.22 16.06,50.61 16.88,49.8 18.45,49.8
  Bottom 0.203: R13.1 14.2,50.36 14.85,51.01 15.86,51.01 v16.06,51.22
N$11
  Top 0.203: 23.7,28.87 IC1.1 23.79,28.95 23.79,29.48 24.6,30.29 24.6,30.49 27,32.89 JP2.1
N$12  (via drill 0.38)
  Top 0.203: IC1.48 24.39,29.48 25.01,30.09 25.01,30.34 26.58,31.91 27.04,31.91 v27.44,32.32
  Bottom 0.203: JP2.2 27,35.64 25.61,34.25 25.61,33.34 26.43,32.52 27.24,32.52 v27.44,32.32
N$13
  Top 0.203: U$4.2 13.54,27.29 14.05,27.8 14.05,29.3 C17.2
N$14
  Top 0.203: 17.9,40.85 U$2.1 | 19.32,42.07 19.17,42.07 19.17,42.23 C18.2
  Top 0.406: U$2.1 18.81,40.76 19.32,41.26 19.32,42.07 19.32,42.13
N$15
  Top 0.203: C19.2 16.1,42 15.81,41.71
  Top 0.406: U$2.3 15.81,41.71
N$16  (via drill 0.38)
  Top 0.203: 16.12,24.13 16.12,24.01 v16.1,24
  Top 0.254: IC1.21 16.24,24.13 v16.1,24
  Bottom 0.203: R2.1 14.23,48.37 13.63,47.76 12.81,47.76 12.41,47.36 12.41,27.85 16.1,24.15 v16.1,24
  Bottom 0.406: R2.1 14.2,49.03 R12.1
N$17  (via drill 0.38)
  Top 0.254: IC1.20 16.87,24.63 16.45,25.05 v16.41,25.05
  Bottom 0.203: v16.41,25.05 15.82,25.05 12.81,28.05 12.81,46.34 13.3,46.83 14.2,46.83
  Bottom 0.406: R3.1 14.2,46.83 R11.1
N$18
  Bottom 0.406: R13.2 LED5.C
N$19
  Top 0.203: U$3.2 19.36,46.18 C22.1
N$20
  Bottom 0.406: R3.2 16.79,46.83 LED2.A
N$21
  Bottom 0.406: R11.2 LED4.C
N$22
  Bottom 0.406: R12.2 16.89,47.92 LED3.C
N$23
  Top 0.203: JP3.4 27,22.46
  Top 0.254: IC1.39 25.87,23.63 JP3.4
N$24  (via drill 0.38)
  Top 0.203: 28.05,54.47 v28.05,54.67 28.26,54.47 28.26,45.93 27.54,45.22 S1.2 27.75,42.44 27.75,40.96 D3.A 27.8,40.73
  Top 0.254: R5.2 27.91,40.62 D3.A
  Bottom 0.203: S2.3 19.47,51.85 17.67,51.85 15.86,53.66 15.86,56.3 19.11,59.55 23.58,59.55 23.79,59.35 23.79,57.52 24.39,56.91 25.41,56.91 26.02,56.3 26.02,55.08 26.43,54.67 v28.05,54.67
N$25
  Top 0.203: D4.C D3.C 26.44,40.87 26.43,40.85 26.43,44.31 26.83,44.72 26.83,45.73 | R4.2 26.17,46.6 26.83,45.93 26.83,45.73 | 26.83,45.73 27.44,45.73 27.85,46.14 27.85,47.36 26.83,48.37 26.83,49.19 27.44,49.8 27.44,53.66 26.63,54.47 25.66,54.47 25.66,54.64 IC2.3
N$26  (via drill 0.38)
  Top 0.203: v25.82,21.55 26.18,21.18 26.39,21.18 26.43,21.14 26.83,21.14 27.14,20.84 27.14,19.51 C28.2 27.09,18.95 27.24,18.95 27.24,18.71 27.44,18.5 27.65,18.5 28.05,18.1 R10.1
  Top 0.254: IC1.40 26.17,24.13 JP3.3
  Bottom 0.203: v25.82,21.55 26.02,21.55 25.61,21.96 25.61,23.58 JP3.3
N$28  (via drill 0.38)
  Top 0.203: IC1.2 23.18,29.47 23.18,29.48 24.19,30.49 24.19,30.69 25.82,32.32 25.82,32.93 25.61,33.13 25.61,35.16 v25.82,35.37
  Bottom 0.203: v25.82,35.37 25.61,35.57 25.61,36.99 27.04,38.42 27.04,40.65 26.63,41.06 25.61,41.06 25.21,41.46 25.21,42.68 26.02,43.5 26.63,43.5 27.04,43.9 27.04,45.33 28.26,46.54 28.26,50.84 S4.3
N$29  (via drill 0.38)
  Top 0.203: IC1.23 16.84,23.13 16.27,22.57 v16.27,22.36
  Bottom 0.203: 13.22,16.27 TP1.TP 12.61,16.88 12.61,22.57 12.81,22.77 15.45,22.77 15.66,22.57 16.06,22.57 v16.27,22.36
N$30
  Top 0.203: 25.01,55.9 D2.C
  Top 0.254: D2.C 25.21,55.88 25.22,55.89
  Top 0.406: D5.C 25.81,58.14 26.22,57.72 26.22,56.3 25.82,55.89 25.22,55.89 | 25.01,55.9 25.01,55.49 24.6,55.08 24.6,52.84 24.8,52.64 25.56,52.64 25.65,52.73 IC2.1 25.65,51.9 25.31,51.56 C29.2
N$31
  cutout Top: 20.74,47.15 22.36,47.15 22.77,46.75 22.77,45.32 22.16,44.72 20.74,44.72 20.33,45.12 20.33,46.75
N$32
  cutout Top: 18.3,28.46 23.99,28.46 24.4,28.05 24.4,23.18 23.58,22.36 18.3,22.36 17.69,22.97 17.69,28.26
N$33
  Top 0.203: 20.53,52.8 R14.1 20.74,52.8 20.74,51.22 20.33,50.81 20.33,50 20.19,49.86 U2.5
P_INT
  Top 0.203: U$4.6 16.05,26.04 16.27,25.82 16.72,25.82 16.93,25.61 17.45,25.61 IC1.18 17.1,25.63
SCL  (via drill 0.38)
  Top 0.203: U$4.8 15.77,28.54 16.45,27.85 v16.45,27.75 16.56,27.63 IC1.14 | 12.41,41.26 12.41,34.15 13.02,33.54 v14.03,33.54 13.48,32.99 R6.1 | 12.41,41.26 12.41,43.9 12.69,44.19 U$1.4 | v13.93,41.21 12.46,41.21 12.41,41.26 | v18.35,41.82 18.35,42.73 18.71,43.09 18.91,43.09 19.11,43.29 19.11,44.92 19.37,45.18 U$3.4
  Bottom 0.203: v14.03,33.54 13.63,33.54 13.63,28.46 14.34,27.75 v16.45,27.75 | v18.35,41.82 17.74,41.21 v13.93,41.21
SDA  (via drill 0.38)
  Top 0.203: 15.87,27.29 U$4.7 15.82,27.29 v16.42,26.68 16.87,27.13 IC1.15 | v14.64,41.92 14.13,42.43 14.13,42.99 14.12,43 U$1.6 | U$3.6 21.05,43.3 20.99,43.24 | R7.1 21.35,41.19 21.35,42.89 20.99,43.24 | v19.93,43.24 20.99,43.24
  Bottom 0.203: v16.42,26.68 14.79,26.68 13.22,28.26 13.22,41.67 13.42,41.67 13.63,41.87 14.59,41.87 v14.64,41.92 17.54,41.92 18.86,43.24 v19.93,43.24
SWITCHON
  Top 0.203: IC1.46 25.1,27.13 25.82,27.85 25.82,28.26 26.33,28.76 28.15,28.76 28.26,28.87 28.26,38.06
  Top 0.254: 28.26,38.06 28.26,38.11 R5.1
VBAT  (via drill 0.3, 0.38)
  Top 0.203: IC1.47 24.99,27.63 25.41,28.05 v25.41,28.87 | R8.2 24.6,45.13 24.6,44.51 24.19,44.11 C27.1 24.19,43.7 24.8,43.09 24.91,43.09 R9.1 25.82,42.19 v25.82,41.77
  Bottom 0.203: v25.82,41.77 26.12,41.77 26.43,41.46 26.83,41.46 27.44,40.85 27.44,38.42 28.26,37.6 28.26,28.87 28.15,28.76 25.51,28.76 v25.41,28.87
VCORE
  Top 0.254: IC1.7 20.68,30.32 C1.2
(copper drawn outside any net)
  shapes: Bottom area x2, Top area x7

### Text on the board
_tsilk: +
_bsilk: + | TOP | ON/OFF | CLR | CHG | PWR | MEM | ROCKET LOGGER | TX | C | MI | SC | MO | RX | VCC | GND | SD | RST | TST | V1 JAN 14 | M BREJZA